# EAGLE design sqrwear2.0 (EAGLE 6.4)
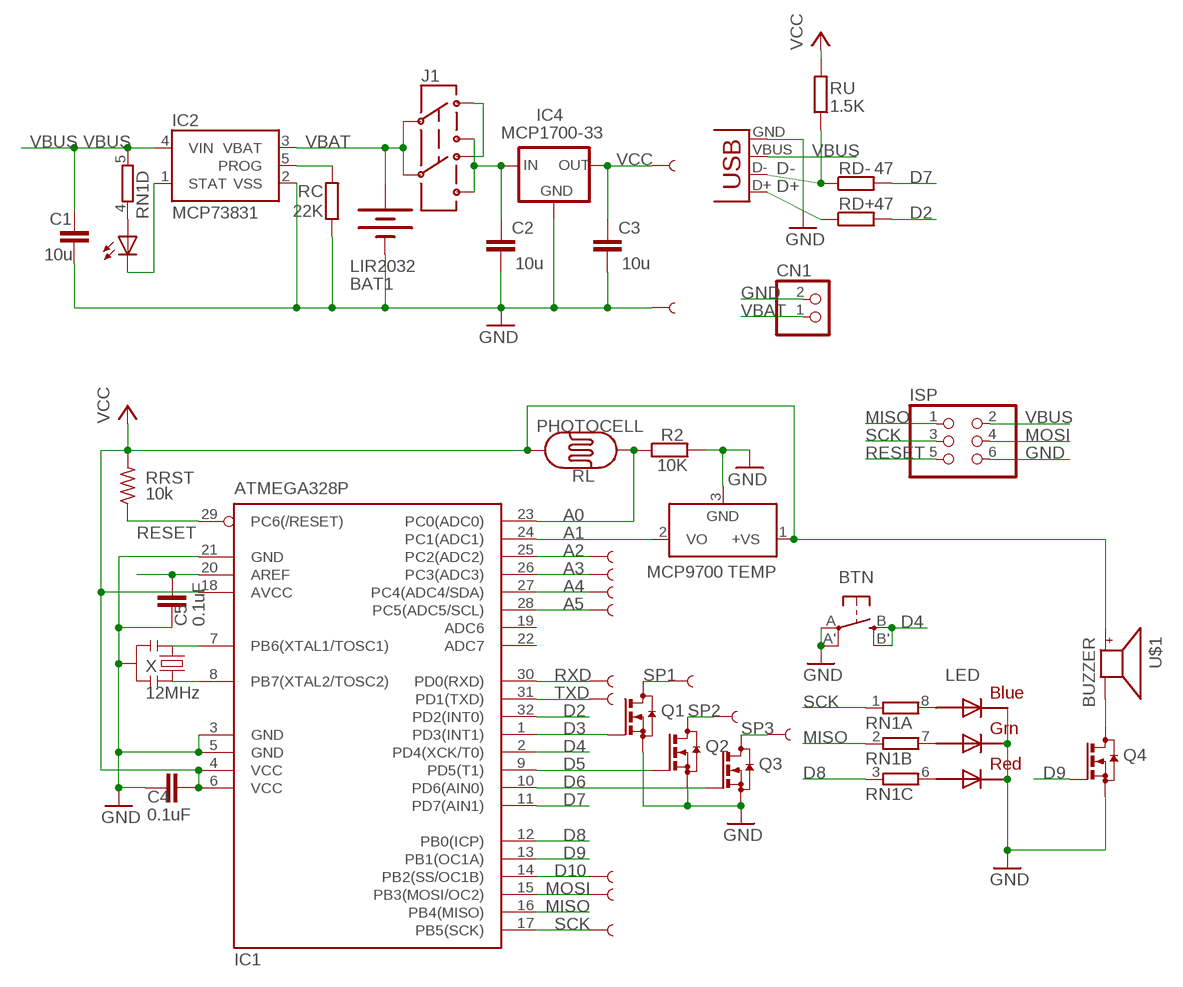
[diagram p0: schematic, sheet 1]

## Parts
BAT1  LIR2032  BATTERYBATTCOM_20MM_PTH_SMT  [BATTCOM_20MM_PTH_SMT]
BTN  EVQQ2  [EVQ-Q2]
C1  10u  C-EUC0805  [C0805]
C2  10u  C-EUC0805  [C0805]
C3  10u  C-EUC0805  [C0805]
C4  0.1uF  C-EUC0805  [C0805]
C5  0.1uF  C-EUC0805  [C0805]
CHG  0805  LEDCHIPLED_0805  [CHIPLED_0805]
CN1  JST_2PIN-SMT-RA  [JST-PH-2-SMT-RA]
IC1  ATMEGA328P  MEGA8-AI  [TQFP32-08]
IC2  MCP73831  [SOT23-5]
IC4  MCP1700-33  MCP1700SOT233  [SOT23]
ISP  PINHD-2X3  [2X03]
J1  AYZ0202  [AYZ0202]
LED  RGBLED5050  [RGBLED5050]
PAD_3  SEWTAP6  SEWTAP611  [PETAL-SMALL-2SIDE11]
PAD_5  SEWTAP6  SEWTAP61  [PETAL-SMALL-2SIDE1]
PAD_6  SEWTAP6  SEWTAP61  [PETAL-SMALL-2SIDE1]
PAD_10  SEWTAP6  SEWTAP611  [PETAL-SMALL-2SIDE11]
PAD_11  SEWTAP6  SEWTAP61  [PETAL-SMALL-2SIDE1]
PAD_13  SEWTAP6  SEWTAP61  [PETAL-SMALL-2SIDE1]
PAD_A2  SEWTAP6  SEWTAP61  [PETAL-SMALL-2SIDE1]
PAD_A3  SEWTAP6  SEWTAP61  [PETAL-SMALL-2SIDE1]
PAD_A4  SEWTAP6  SEWTAP611  [PETAL-SMALL-2SIDE11]
PAD_A5  SEWTAP6  SEWTAP611  [PETAL-SMALL-2SIDE11]
PAD_GND  SEWTAP6  SEWTAP611  [PETAL-SMALL-2SIDE11]
PAD_RXD  SEWTAP61  [PETAL-SMALL-2SIDE1]
PAD_TXD  SEWTAP6  SEWTAP61  [PETAL-SMALL-2SIDE1]
PAD_VCC  SEWTAP6  SEWTAP611  [PETAL-SMALL-2SIDE11]
Q1  BSS123  [SOT23]
Q2  BSS123  [SOT23]
Q3  BSS123  [SOT23]
Q4  BSS123  [SOT23]
R2  10K  R-EU_R0805  [R0805]
RC  22K  R-EU_R0805  [R0805]
RD+  47  R-EU_R0805  [R0805]
RD-  47  R-EU_R0805  [R0805]
RL  PHOTOCELL  PHOTOCELLPTH  [PHOTOCELL]
RN1  4R-NEXB38V  [EXB38V]
RRST  10k  R-US_R0805  [R0805@1]
RU  1.5K  R-EU_R0805  [R0805]
TEMP  MCP9700  LM50  [SOT23]
U$1  BUZZER  [SMT-8585-BUZZER]
X  12MHz  RESONATORSMD  [RESONATOR-SMD]
X1  USBSMD  [USB-MINIB]

## Nets
A0: IC1.23(PC0(ADC0)) R2.1 RL.1
A1: IC1.24(PC1(ADC1)) TEMP.2(VO)
A2: IC1.25(PC2(ADC2)) PAD_A2.1
A3: IC1.26(PC3(ADC3)) PAD_A3.1
A4: IC1.27(PC4(ADC4/SDA)) PAD_A4.1
A5: IC1.28(PC5(ADC5/SCL)) PAD_A5.1
AREF: C5.2 IC1.20(AREF)
D2: IC1.32(PD2(INT0)) RD+.2
D3: IC1.1(PD3(INT1)) Q1.1(G)
D4: BTN.B'(S1) BTN.B(S) IC1.2(PD4(XCK/T0))
D5: IC1.9(PD5(T1)) Q2.1(G)
D6: IC1.10(PD6(AIN0)) Q3.1(G)
D7: IC1.11(PD7(AIN1)) RD-.2
D8: IC1.12(PB0(ICP)) RN1.3
D9: IC1.13(PB1(OC1A)) Q4.1(G)
D10: IC1.14(PB2(SS/OC1B)) PAD_10.1
D+: RD+.1 X1.D+
D-: RD-.1 RU.1 X1.D-
GND: BAT1.P$1(-) BTN.A'(P1) BTN.A(P) C1.2 C2.2 C3.2 C4.1 C5.1 CN1.2 IC1.3(GND) IC1.5(GND) IC1.21(GND) IC2.2(VSS) IC4.1(GND) ISP.6 LED.4(BLUE_C) LED.5(RED_C) LED.6(GREEN_C) PAD_GND.1 Q1.2(S) Q2.2(S) Q3.2(S) Q4.2(S) R2.2 RC.1 TEMP.3(GND) X1.GND X.2
MISO: IC1.16(PB4(MISO)) ISP.1 RN1.2
MOSI: IC1.15(PB3(MOSI/OC2)) ISP.4 PAD_11.1
N$1: J1.3 J1.6
N$2: IC1.7(PB6(XTAL1/TOSC1)) X.1
N$3: IC1.8(PB7(XTAL2/TOSC2)) X.3
N$4: LED.3(BLUE_A) RN1.8
N$5: CHG.C IC2.1(STAT)
N$6: IC2.5(PROG) RC.2
N$7: Q4.3(D) U$1.-
N$8: LED.1(GREEN_A) RN1.7
N$9: LED.2(RED_A) RN1.6
N$10: CHG.A RN1.4
RESET: IC1.29(PC6(/RESET)) ISP.5 RRST.1
RXD: IC1.30(PD0(RXD)) PAD_RXD.1
SCK: IC1.17(PB5(SCK)) ISP.3 PAD_13.1 RN1.1
SP1: PAD_3.1 Q1.3(D)
SP2: PAD_5.1 Q2.3(D)
SP3: PAD_6.1 Q3.3(D)
TXD: IC1.31(PD1(TXD)) PAD_TXD.1
VBAT: BAT1.P$2(+) CN1.1 IC2.3(VBAT) J1.2 J1.5
VBUS: C1.1 IC2.4(VIN) ISP.2 RN1.5 X1.VBUS
VCC: C3.1 C4.2 IC1.4(VCC) IC1.6(VCC) IC1.18(AVCC) IC4.2(OUT) PAD_VCC.1 RL.2 RRST.2 RU.2 TEMP.1(+VS) U$1.+
VDD: C2.1 IC4.3(IN) J1.1 J1.4
Unconnected: IC1.19(ADC6) IC1.22(ADC7)

## Library data of the parts
BAT1 = SparkFunNew:BATTERY: Battery Holders Various common sizes : AA, AAA, 20mm coin cell and 12mm coin cell.
BTN = adafruit:EVQQ2: SMT 6mm switch, EVQQ2 series http://www.ladyada.net/library/eagle
C1-C3 = resistor:C-EU: CAPACITOR, European symbol
C4 C5 = rcl:C-EU: CAPACITOR, European symbol
CHG = led:LED: LED OSRAM: - CHIPLED LG R971, LG N971, LY N971, LG Q971, LY Q971, LO R971, LY R971 LH N974, LH R974 LS Q976, LO Q976, LY Q976 LO Q996 - Hyper CHIPLED LW Q18S LB Q993, LB Q99A, LB R99A - SideLED LS A670, LO A670, LY A670, LG A670, LP A670 LB A673, LV A673, LT A673, LW A673 LH A674 LY A675 LS A676, LA A676, LO A676, LY A676, LW A676 LS A679, LY A679, LG A679 - Hyper Micro SIDELED® LS Y876, LA Y876, LO Y876, LY Y876 LT Y87S - SmartLED LW L88C, LW L88S LB L89C, LB L89S, LG L890 LS L89K, LO L89K, LY L89K LS L896, LA L896, LO L896, LY L896 - TOPLED LS T670, LO T670, LY T670, LG T670, LP T670 LSG T670, LSP T670, LSY T670, LOP T670, LYG T670 LG T671, LOG T671, LSG T671 LB T673, LV T673, LT T673, LW T673 LH T674 LS T676, LA T676, LO T676, LY T676, LB T676, LH T676, LSB T676, LW T676 LB T67C, LV T67C, LT T67C, LS T67K, LO T67K, LY T67K, LW E67C LS E67B, LA E67B, LO E67B, LY E67B, LB E67C, LV E67C, LT E67C LW T67C LS T679, LY T679, LG T679 LS T770, LO T770, LY T770, LG T770, LP T770 LB T773, LV T773, LT T773, LW T773 LH T774 LS E675, LA E675, LY E675, LS T675 LS T776, LA T776, LO T776, LY T776, LB T776 LHGB T686 LT T68C, LB T68C - Hyper Mini TOPLED® LB M676 - Mini TOPLED Santana® LG M470 LS M47K, LO M47K, LY M47K Source: http://www.osram.convergy.de LUXEON: - LUMILED® LXK2-PW12-R00, LXK2-PW12-S00, LXK2-PW14-U00, LXK2-PW14-V00 LXK2-PM12-R00, LXK2-PM12-S00, LXK2-PM14-U00 LXK2-PE12-Q00, LXK2-PE12-R00, LXK2-PE12-S00, LXK2-PE14-T00, LXK2-PE14-U00 LXK2-PB12-K00, LXK2-PB12-L00, LXK2-PB12-M00, LXK2-PB14-N00, LXK2-PB14-P00, LXK2-PB14-Q00 LXK2-PR12-L00, LXK2-PR12-M00, LXK2-PR14-Q00, LXK2-PR14-R00 LXK2-PD12-Q00, LXK2-PD12-R00, LXK2-PD12-S00 LXK2-PH12-R00, LXK2-PH12-S00 LXK2-PL12-P00, LXK2-PL12-Q00, LXK2-PL12-R00 Source: www.luxeon.com KINGBRIGHT: KA-3528ASYC Source: www.kingbright.com
CN1 = adafruit:JST_2PIN: JST 2-Pin Connectors of various flavors SMT-RA (S2B-PH-SM4) 4UConnector #17311 SMT (B2B-PH-SM4) THM-RA (S2B-PH) THM (B2B-PH)
IC1 = atmel:MEGA8: MICROCONTROLLER 8 Kbytes FLASH, 1 kbytes SRAM, 512 bytes EEPROM, USART, 6-channel 10 bit ADC, 2-channel 8 bit ADC Pin compatible with Atmega48, ATMega88, ATMega168 Source: avr.lbr; MPN: ATMEGA8-16AU; OC_FARNELL: 9171371; OC_NEWARK: 73M8863
IC2 = SparkFunNew:MCP73831: Microchip's MCP73831 Miniature single cell, fully integrated Li-Ion, Li-polymer charge management controller http://ww1.microchip.com/downloads/en/DeviceDoc/21984a.pdf
IC4 = adafruit:MCP1700: VOLTAGE REGULATOR
ISP = pinhead:PINHD-2X3: PIN HEADER
J1 = SparkFunNew:AYZ0202: SPDT Slide Switch Simple SMD single-pull double-throw slide switch. Good for less than 350mA power switch, switching UARTs between devices, etc. Spark Fun Electronics SKU : COM-00597
LED = adafruit:RGBLED: For 5050 RGB LEDs, the order of the LEDs may vary from one manufacturer to another!
PAD_3 PAD_5 PAD_6 PAD_10 PAD_11 PAD_13 PAD_A2-PAD_A5 PAD_GND PAD_RXD PAD_TXD PAD_VCC = LilyPad-Wearables:SEWTAP
Q1-Q4 = transistor-small-signal:BSS123: N-CHANNEL MOS FET
R2 RC RD+ RD- RU = rcl:R-EU_: RESISTOR, European symbol
RL = SparkFunNew:PHOTOCELL: Photocell Also known as a CdS photoresistor. This is a low cost way to detect light levels. Resistance decreases with more incoming light. SparkFun SKU: SEN-09088
RN1 = resistor-dil:4R-N: Array Chip Resistor Source: RS Component / Phycomp; OC_FARNELL: unknown; OC_NEWARK: unknown
RRST = rcl:R-US_: RESISTOR, American symbol
TEMP = linear:LM50: SOT-23 Single-Supply Centigrade Temperature Sensor Vout = (10mV/°C x Temp °C) +5mmmV Source: http://cache.national.com/ds/LM/LM50.pdf
U$1 = adafruit:BUZZER
X = SparkFunNew:RESONATOR: Resonator Small SMD resonator. This is the itty bitty 10/20MHz resonators with built in caps. CSTCE10M0G55 and CSTCE20M0V53. Footprint has been reviewed closely but hasn't been tested yet.
X1 = SparkFun:USB: USB Connectors USB-B-PTH is fully proven SKU : PRT-00139 USB-miniB is fully proven SKU : PRT-00587 USB-A-PCB is untested. USB-A-H is throughly reviewed, but untested. Spark Fun Electronics SKU : PRT-00437 USB-B-SMT is throughly reviewed, but untested. Needs silkscreen touching up. USB-A-S has not been used/tested USB-MB-H has not been used/tested

## Net classes
0 default: width 0.254 mm, clearance 0.203 mm
1 power: width 0.254 mm, clearance 0.203 mm

## Board
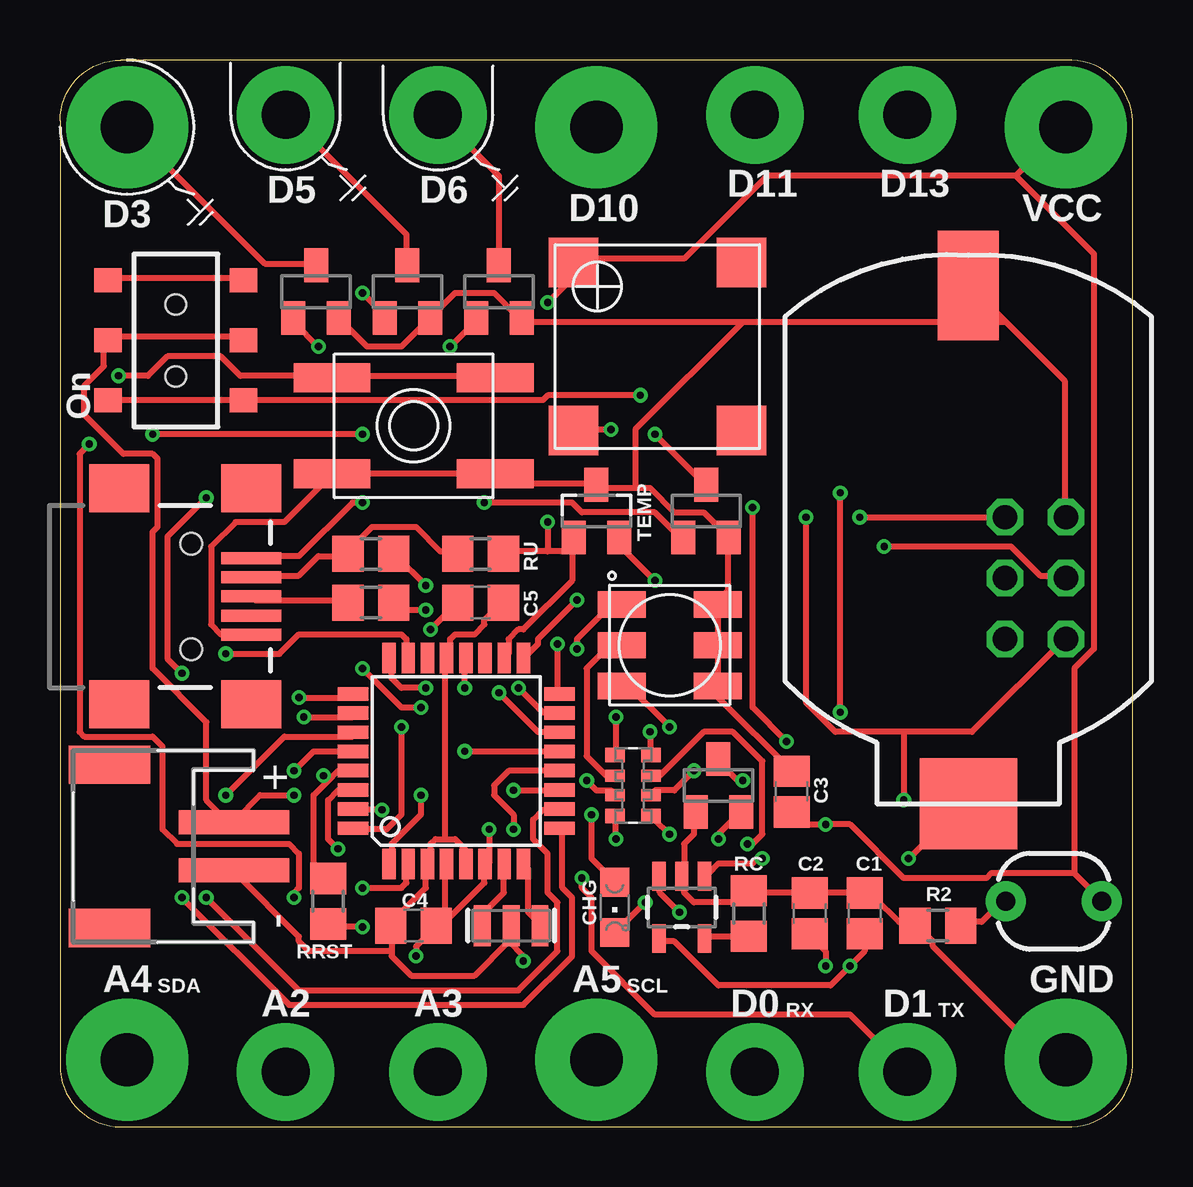
[diagram p1: board, top side]
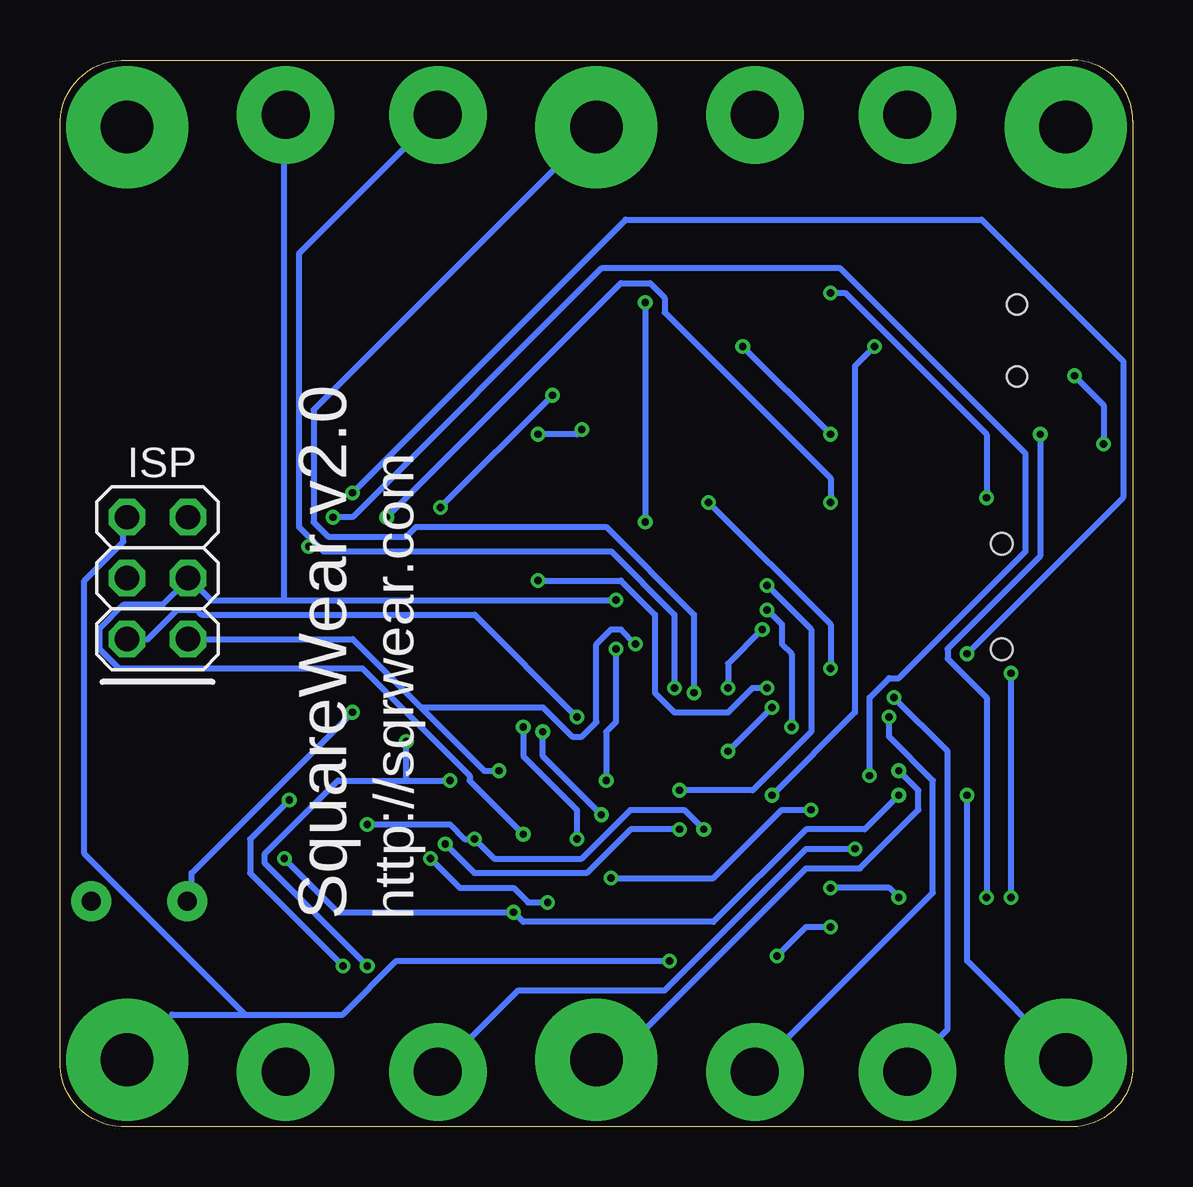
[diagram p2: board, bottom side, seen from below]

Size 44.7 x 44.45 mm. Coordinates in mm from the lower left corner, seen from the top.
Outline: 2.54,0 41.91,0 arc90 44.7,2.54 44.7,41.91 arc90 41.91,44.45 2.54,44.45 arc90 0,41.91 0,2.54 arc90 2.54,0
Copper layers (1*16): Top 0.035mm / dielectric 1.5mm / Bottom 0.035mm
Design rules "Fusion_eagle_rule_v1.1 *": minimum track width 6mil, minimum drill 12mil, track to track 6mil, track to pad 6mil, pad to pad 6mil, via to via 6mil, smd to smd 0mil, copper to edge 10mil, drill to drill 10mil, minimum pad ring 10mil, minimum via ring 6mil, stop-mask expansion 2mil, vias tented up to drill 100mil, thermal gap 25mil
vRestrict: area 21.6,8.4 to 22.4,9.9; area 1.5,37.6 to 6.6,38.6; area 8.1,38.4 to 12.7,39.6; area 14.2,38.4 to 18.8,39.6; area 27.7,38.9 to 30.5,39.9; area 40.4,37.8 to 43.2,38.9; area 40.4,5.6 to 43.2,6.6; area 8.4,14 to 9.4,15; area 20.8,37.6 to 24.1,38.9; area 21.3,5.6 to 24.9,6.9

### Footprints (pad centres in the part's own frame; a part is rotated, then mirrored left to right if it is on the bottom)
BATTCOM_20MM_PTH_SMT = smd 4.572 x 2.54: P$1 0,0 | smd 3.81 x 4.064: P$2 21.59,0
EVQ-Q2 = smd 3.2 x 1.2: A -3.4,-2; A' 3.4,-2; B -3.4,2; B' 3.4,2
C0805 = smd 1.3 x 1.5: 1 -0.85,0; 2 0.85,0
C0805' = smd 1.3 x 1.5: 1 -0.95,0; 2 0.95,0
CHIPLED_0805 = smd 1.2 x 1.2: A 0,-1.05; C 0,1.05
JST-PH-2-SMT-RA = smd 1 x 4.6: 1 1,-3.7; 2 -1,-3.7 | smd 1.6 x 3.4: NC1 -3.4,1.5; NC2 3.4,1.5
TQFP32-08 = smd 1.27 x 0.559: 1 -4.293,2.8; 2 -4.293,2; 3 -4.293,1.2; 4 -4.293,0.4; 5 -4.293,-0.4; 6 -4.293,-1.2; 7 -4.293,-2; 8 -4.293,-2.8; 17 4.293,-2.8; 18 4.293,-2; 19 4.293,-1.2; 20 4.293,-0.4; 21 4.293,0.4; 22 4.293,1.2; 23 4.293,2; 24 4.293,2.8 | smd 0.559 x 1.27: 9 -2.8,-4.293; 10 -2,-4.293; 11 -1.2,-4.293; 12 -0.4,-4.293; 13 0.4,-4.293; 14 1.2,-4.293; 15 2,-4.293; 16 2.8,-4.293; 25 2.8,4.293; 26 2,4.293; 27 1.2,4.293; 28 0.4,4.293; 29 -0.4,4.293; 30 -1.2,4.293; 31 -2,4.293; 32 -2.8,4.293
SOT23-5 = smd 0.55 x 1.2: 1 -0.95,-1.3; 2 0,-1.3; 3 0.95,-1.3; 4 0.95,1.3; 5 -0.95,1.3
SOT23 = smd 1 x 1.4: 1 -0.95,-1.1; 2 0.95,-1.1; 3 0,1.1
2X03 = drill 1.016 octagon: 1 -2.54,-1.27; 2 -2.54,1.27; 3 0,-1.27; 4 0,1.27; 5 2.54,-1.27; 6 2.54,1.27
AYZ0202 = smd 1 x 1.15: 1 -2.5,2.825; 2 0,2.825; 3 2.5,2.825; 4 -2.5,-2.825; 5 0,-2.825; 6 2.5,-2.825 | hole 0.85: 1.5,0; -1.5,0
RGBLED5050 = smd 2 x 1.1: 1 -2,1.7; 2 -2,0; 3 -2,-1.7; 4 2,-1.7; 5 2,0; 6 2,1.7
PETAL-SMALL-2SIDE11 = drill 2.2 pad 5.08: 1 0,0
PETAL-SMALL-2SIDE1 = drill 2 pad 4.064: 1 0,0
R0805 = smd 1.3 x 1.5: 1 -0.95,0; 2 0.95,0
PHOTOCELL = drill 0.8 pad 1.676: 1 -2,0; 2 2,0
EXB38V = smd 0.6 x 0.8: 1 -1.275,-0.75; 4 1.275,-0.75; 5 1.275,0.75; 8 -1.275,0.75 | smd 0.5 x 0.8: 2 -0.4,-0.75; 3 0.4,-0.75; 6 0.4,0.75; 7 -0.4,0.75
R0805@1 = smd 1.3 x 1.5: 1 -0.95,0; 2 0.95,0
SMT-8585-BUZZER = smd 2.05 x 2.05: + -3.5,-3.5; - 3.5,-3.5; NC1 -3.5,3.5; NC2 3.5,3.5
RESONATOR-SMD = smd 0.7 x 1.7: 1 -1.2,0; 2 0,0; 3 1.2,0
USB-MINIB = smd 2.5 x 0.5: D+ 2.5,0; D- 2.5,0.8; GND 2.5,-1.6; ID 2.5,-0.8; VBUS 2.5,1.6 | smd 2.5 x 2: GND@1 -3,-4.5; GND@2 -3,4.5; GND@3 2.5,4.5; GND@4 2.5,-4.5 | hole 0.9: 0,2.2; 0,-2.2

### Placement (x,y rotation side)
BAT1  37.85,35.05 270 top
BTN  14.73,29.21 0 top
C1  33.53,8.89 90 top
C2  31.24,8.89 90 top
C3  30.48,13.97 90 top
C4  0.1uF  [C0805']  14.73,8.38 0 top
C5  0.1uF  [C0805']  17.53,21.84 180 top
CHG  23.11,9.14 180 top
CN1  3.56,11.68 90 top
IC1  16.51,15.24 90 top
IC2  25.91,9.14 180 top
IC4  27.43,14.22 0 top
ISP  40.64,22.86 90 bottom
J1  4.83,32.77 90 top
LED  25.4,20.07 0 top
PAD_3  2.79,41.66 180 top
PAD_5  9.4,42.16 180 top
PAD_6  15.75,42.16 0 top
PAD_10  22.35,41.66 180 top
PAD_11  28.96,42.16 180 top
PAD_13  35.31,42.16 180 top
PAD_A2  9.4,2.29 0 top
PAD_A3  15.75,2.29 0 top
PAD_A4  2.79,2.79 90 top
PAD_A5  22.35,2.79 0 top
PAD_GND  41.91,2.79 270 top
PAD_RXD  28.96,2.29 180 top
PAD_TXD  35.31,2.29 0 top
PAD_VCC  41.91,41.66 180 top
Q1  10.67,34.8 0 top
Q2  14.48,34.8 0 top
Q3  18.29,34.8 0 top
Q4  26.92,25.65 0 top
R2  36.58,8.38 180 top
RC  28.7,8.89 270 top
RD+  12.95,21.84 0 top
RD-  12.95,23.88 0 top
RL  41.4,9.4 0 top
RN1  23.88,14.22 90 top
RRST  11.18,9.4 270 top
RU  17.53,23.88 0 top
TEMP  22.35,25.65 0 top
U$1  24.89,32.51 270 top
X  18.8,8.38 0 top
X1  5.46,22.1 0 top

### Tracks (layer width: path | path; a pad name or v marks a point on that pad's centre or on a via)
A0  (via drill 0.3)
  Top 0.254: v6.91,19.71 9.14,19.71 9.96,20.52 14.22,20.52 14.43,20.32 14.43,19.71 IC1.23 | v32.51,17.27 v32.51,26.42 | R2.1 37.59,8.53 38.41,8.53 39.22,9.35 RL.1
  Bottom 0.254: v6.91,19.71 0.41,26.21 0.41,31.9 6.3,37.8 21.13,37.8 v32.51,26.42 | v32.51,17.27 39.22,10.57 39.22,9.55 RL.1
A1  (via drill 0.3)
  Top 0.254: v15.24,18.29 14.22,18.29 13.82,18.69 13.82,19.51 IC1.24 | v24.79,22.76 23.16,24.38 TEMP.2
  Bottom 0.254: v15.24,18.29 15.85,18.29 16.87,17.27 19.1,17.27 19.91,18.09 19.91,21.34 21.34,22.76 v24.79,22.76
A2  (via drill 0.3)
  Top 0.254: v9.96,17.88 12.19,17.88 IC1.25
  Bottom 0.254: v9.96,17.88 7.72,15.65 7.72,4.06 9.35,2.44 PAD_A2.1
A3  (via drill 0.3)
  Top 0.254: v10.16,17.07 12.19,17.07 IC1.26
  Bottom 0.254: v10.16,17.07 10.16,16.26 8.33,14.43 8.33,9.75 15.65,2.44 PAD_A3.1
A4  (via drill 0.3)
  Top 0.254: v6.91,13.82 9.35,16.26 12.19,16.26 IC1.27
  Bottom 0.254: v6.91,13.82 6.91,6.91 PAD_A4.1
A5  (via drill 0.3)
  Top 0.254: v9.75,14.83 10.57,15.65 12.19,15.65 IC1.28
  Bottom 0.254: v9.75,14.83 8.94,14.02 8.94,13.21 11.38,10.77 13.61,10.77 21.54,2.85 22.35,2.85 PAD_A5.1
AREF  (via drill 0.3)
  Top 0.254: v16.87,18.29 16.87,19.51 IC1.20 | v15.44,20.73 16.46,21.74 C5.2
  Bottom 0.254: v16.87,18.29 16.87,19.3 v15.44,20.73
D2  (via drill 0.3)
  Top 0.254: v14.22,16.66 14.22,13.01 13.61,12.4 12.39,12.4 IC1.32 | v15.24,21.54 14.22,21.54 14.02,21.74 RD+.2
  Bottom 0.254: v14.22,16.66 14.22,19.71 14.63,20.12 14.63,20.93 v15.24,21.54
D3  (via drill 0.3)
  Top 0.254: v15.04,13.82 15.04,13.01 13.82,11.79 13.82,10.97 IC1.1 | v10.77,32.51 9.75,33.53 Q1.1
  Bottom 0.254: v15.04,13.82 11.58,17.27 11.58,31.7 v10.77,32.51
D4  (via drill 0.3)
  Top 0.254: v12.6,9.96 14.22,9.96 14.43,10.16 14.43,10.77 IC1.2 | v9.75,9.55 9.75,9.75 9.96,9.96 9.96,11.38 9.55,11.79 4.88,11.79 4.27,12.4 4.27,15.85 3.86,16.26 1.02,16.26 0.81,16.46 0.81,28.04 v1.22,28.45 | v2.44,31.29 3.66,31.29 4.47,32.11 6.71,32.11 7.52,31.29 11.18,31.29 BTN.B 11.38,31.29 18.09,31.29 BTN.B'
  Bottom 0.254: v12.6,9.96 10.16,9.96 v9.75,9.55 | v1.22,28.45 1.22,30.07 v2.44,31.29
D5  (via drill 0.3)
  Top 0.254: v5.08,9.55 9.55,5.08 19.3,5.08 21.34,7.11 21.34,9.55 20.93,9.96 20.93,12.4 IC1.9 | v5.08,18.9 4.47,19.51 4.47,24.59 v6.1,26.21 | v12.6,34.75 13.61,33.73 Q2.1
  Bottom 0.254: v5.08,18.9 v5.08,9.55 | v6.1,26.21 6.1,28.85 11.99,34.75 v12.6,34.75
D6  (via drill 0.3)
  Top 0.254: v6.1,9.55 9.96,5.69 19.1,5.69 20.73,7.32 20.73,9.35 20.32,9.75 20.32,11.38 19.71,11.99 19.71,12.8 20.12,13.21 20.73,13.21 IC1.10 | v12.6,28.85 v3.86,28.85 | v16.26,32.51 17.27,33.53 Q3.1
  Bottom 0.254: v6.1,9.55 6.1,17.88 7.72,19.51 7.72,19.91 3.86,23.77 v3.86,28.85 | v16.26,32.51 v12.6,28.85
D7  (via drill 0.3)
  Top 0.254: v18.9,14.02 20.73,14.02 IC1.11 | v15.24,22.56 14.02,23.77 RD-.2
  Bottom 0.254: v18.9,14.02 15.85,14.02 13.41,16.46 13.41,20.73 v15.24,22.56
D8  (via drill 0.3)
  Top 0.254: v28.65,11.79 28.85,11.79 29.26,12.19 29.26,15.24 28.04,16.46 26.82,16.46 24.99,14.63 24.79,14.63 RN1.3 | v18.9,12.4 18.9,13.01 18.09,13.82 18.09,14.22 18.69,14.83 20.73,14.83 IC1.12
  Bottom 0.254: v28.65,11.79 27.43,10.57 22.76,10.57 20.93,12.4 v18.9,12.4
D9  (via drill 0.3)
  Top 0.254: v16.87,15.65 20.73,15.65 IC1.13 | v15.04,17.48 14.22,17.48 v12.6,19.1 | v17.68,26.01 21.34,26.01 21.74,25.6 24.79,25.6 25.81,24.59 Q4.1
  Bottom 0.254: v15.04,17.48 v16.87,15.65 | v12.6,19.1 12.6,20.93 v17.68,26.01
D10  (via drill 0.3)
  Top 0.254: v18.29,18.09 19.91,16.46 20.73,16.46 IC1.14
  Bottom 0.254: v18.29,18.09 18.29,21.34 21.95,24.99 29.87,24.99 30.28,24.59 33.53,24.59 34.14,25.2 34.14,29.87 PAD_10.1
D+
  Top 0.254: RD+.1 11.99,21.95 8.13,21.95 X1.D+
D-
  Top 0.254: X1.D- 8.13,22.96 9.96,22.96 10.77,23.77 11.99,23.77 RD-.1 11.99,23.98 13.01,24.99 14.83,24.99 15.85,23.98 16.46,23.98 RU.1
GND  (via drill 0.3)
  Top 0.254: C3.2 30.48,14.83 27.43,17.88 27.43,18.29 LED.4 27.43,18.49 27.43,19.91 LED.5 27.43,20.12 27.43,21.74 LED.6 27.43,21.95 27.84,22.35 27.84,24.38 Q4.2 27.84,24.59 26.82,25.6 25.6,25.6 24.59,26.62 23.98,26.62 | X1.GND 7.92,20.52 6.71,20.52 6.3,20.93 6.3,24.18 7.32,25.2 9.35,25.2 11.18,27.03 BTN.A 11.38,27.23 18.09,27.23 BTN.A' 18.29,27.03 18.49,26.82 22.35,26.82 TEMP.3 22.35,26.62 23.98,26.62 | Q1.2 11.79,33.53 12.8,32.51 14.22,32.51 15.24,33.53 Q2.2 15.44,33.73 16.46,34.75 18.09,34.75 19.1,33.73 Q3.2 19.3,33.53 28.45,33.53 | 39.42,33.53 38,34.95 BAT1.P$1 | 39.42,33.53 41.86,31.09 41.86,25.4 ISP.6 | 39.42,33.53 28.45,33.53 | 23.98,26.62 23.98,29.06 28.45,33.53 | 16.05,11.99 15.65,11.99 15.44,11.79 15.44,10.97 IC1.3 15.24,10.77 15.24,9.96 13.82,8.53 C4.1 13.82,8.33 13.82,7.32 | 16.05,11.99 16.46,11.99 16.87,11.58 16.87,10.97 IC1.5 | 16.05,11.99 16.05,19.51 IC1.21 16.26,19.71 16.26,20.32 16.46,20.52 17.27,20.52 17.68,20.93 17.68,21.13 18.29,21.74 C5.1 | 18.69,7.72 18.69,8.33 X.2 18.69,7.72 | 18.69,7.72 17.27,6.3 14.63,6.3 13.82,7.11 13.82,7.32 | 13.82,7.32 10.36,7.32 9.96,7.72 9.96,7.93 7.32,10.57 CN1.2 | IC4.1 26.42,13.01 26.42,12.19 26.01,11.79 26.01,10.57 IC2.2 26.01,10.36 26.01,9.75 26.42,9.35 28.25,9.35 28.65,9.75 RC.1 28.85,9.75 31.09,9.75 C2.2 31.29,9.75 33.53,9.75 C1.2 33.53,9.55 33.93,9.55 34.95,8.53 35.56,8.53 R2.2 35.76,8.33 36.37,7.72 36.37,7.52 41.05,2.85 41.86,2.85 PAD_GND.1 | 18.69,7.72 19.3,7.11 v19.3,6.91
  Bottom 0.254: v19.3,6.91 30.68,6.91 32.92,4.67 36.98,4.67 | 36.98,4.67 40.03,4.67 PAD_GND.1 | 36.98,4.67 43.69,11.38 43.69,22.76 42.06,24.38 42.06,25.4 ISP.6
MISO  (via drill 0.3)
  Top 0.254: v26.42,14.83 25.6,14.02 24.79,14.02 RN1.2 | v20.73,20.12 20.73,18.09 IC1.16
  Bottom 0.254: v26.42,14.83 27.03,14.83 29.67,17.48 | 29.67,17.48 32.51,20.32 ISP.1 | v20.73,20.12 21.34,20.73 21.74,20.73 22.35,20.12 22.35,16.87 22.96,16.26 23.37,16.26 24.59,17.48 29.67,17.48
MOSI  (via drill 0.3)
  Top 0.254: v19.1,18.29 20.12,17.27 20.73,17.27 IC1.15 | v34.34,24.18 39.62,24.18 40.84,22.96 41.86,22.96 ISP.4
  Bottom 0.254: v19.1,18.29 19.1,21.34 21.74,23.98 33.73,23.98 34.14,24.38 | 34.14,24.38 34.75,24.99 34.75,36.37 PAD_11.1 | 34.14,24.38 v34.34,24.18
N$1
  Top 0.254: J1.3 2.03,35.36 7.52,35.36 J1.6
N$2
  Top 0.254: IC1.7 18.49,10.77 18.49,9.75 17.68,8.94 17.68,8.53 X.1
N$3
  Top 0.254: IC1.8 19.51,10.77 19.51,8.94 19.91,8.53 X.3
N$4  (via drill 0.3)
  Top 0.254: v23.16,11.99 23.16,12.8 RN1.8 | v25.4,16.66 23.57,18.49 LED.3
  Bottom 0.254: v23.16,11.99 23.16,13.21 25.4,15.44 v25.4,16.66
N$5  (via drill 0.3)
  Top 0.254: v24.38,9.35 23.16,8.13 CHG.C | v29.26,11.18 29.06,11.18 28.85,10.97 27.43,10.97 27.03,10.57 IC2.1
  Bottom 0.254: v24.38,9.35 25.2,9.35 25.81,9.96 28.04,9.96 v29.26,11.18
N$6
  Top 0.254: IC2.5 27.03,7.93 28.65,7.93 RC.2
N$7  (via drill 0.3)
  Top 0.254: v24.79,28.85 26.82,26.82 Q4.3 | v22.96,29.06 21.54,29.06 U$1.-
  Bottom 0.254: v24.79,28.85 23.16,28.85 v22.96,29.06
N$8  (via drill 0.3)
  Top 0.254: v21.95,14.43 22.35,14.02 22.96,14.02 RN1.7 | v21.54,19.91 21.54,20.32 22.96,21.74 23.37,21.74 LED.1
  Bottom 0.254: v21.95,14.43 21.95,16.46 21.54,16.87 v21.54,19.91
N$9
  Top 0.254: RN1.6 22.96,14.63 22.76,14.63 21.95,15.44 21.95,19.1 22.76,19.91 23.37,19.91 LED.2
N$10  (via drill 0.3)
  Top 0.254: v24.59,16.46 24.59,15.65 RN1.4 | v22.15,13.01 22.15,11.18 22.96,10.36 CHG.A
  Bottom 0.254: v24.59,16.46 24.59,15.44 v22.15,13.01
RESET  (via drill 0.3)
  Top 0.254: 11.18,14.43 10.57,13.82 10.57,10.97 11.18,10.36 RRST.1 | 11.18,14.43 11.58,14.83 12.19,14.83 IC1.29 | v33.33,25.4 ISP.5 | 11.18,14.43 v10.97,14.63
  Bottom 0.254: v33.33,25.4 32.51,25.4 22.15,35.76 12.19,35.76 4.47,28.04 4.47,23.98 9.75,18.69 10.16,18.69 10.97,17.88 v10.97,14.63
RXD  (via drill 0.3)
  Top 0.254: v11.58,11.58 11.18,11.99 11.18,13.61 11.58,14.02 12.19,14.02 IC1.30
  Bottom 0.254: v11.58,11.58 13.61,11.58 19.51,5.69 25.6,5.69 28.85,2.44 PAD_RXD.1
SCK  (via drill 0.3)
  Top 0.254: v25.4,12.19 24.79,12.8 RN1.1 | v21.54,21.95 19.91,20.32 19.91,20.12 19.51,19.71 IC1.17
  Bottom 0.254: v25.4,12.19 27.64,14.43 27.64,14.63 32.11,19.1 42.27,19.1 43.08,19.91 43.08,20.73 42.06,21.74 40.44,21.74 39.42,22.76 ISP.3 39.22,22.76 38.41,21.95 35.36,21.95 | 35.36,21.95 v21.54,21.95 | 35.36,21.95 35.36,42.06 PAD_13.1
SP1
  Top 0.254: Q1.3 10.57,35.97 8.53,35.97 2.85,41.66 PAD_3.1
SP2
  Top 0.254: Q2.3 14.43,35.97 14.43,37.19 9.55,42.06 PAD_5.1
SP3
  Top 0.254: Q3.3 18.29,39.62 PAD_6.1
TXD  (via drill 0.3)
  Top 0.254: v13.41,13.21 12.39,13.21 IC1.31 | v21.74,10.36 21.74,9.96 22.15,9.55 22.15,7.32 24.79,4.67 32.92,4.67 PAD_TXD.1
  Bottom 0.254: v13.41,13.21 14.63,13.21 17.48,10.36 v21.74,10.36
VBAT  (via drill 0.3)
  Top 0.254: J1.5 7.52,32.92 2.03,32.92 J1.2 1.83,32.72 1.83,31.7 1.02,30.89 1.02,29.67 2.64,28.04 3.86,28.04 4.06,27.84 4.06,24.99 3.86,24.79 3.86,19.1 6.1,16.87 6.1,13.61 7.11,12.6 CN1.1 7.32,12.8 8.33,13.82 v9.75,13.82 | v25.81,8.94 24.99,9.75 24.99,10.36 IC2.3 | v35.36,11.18 37.8,13.61 BAT1.P$2
  Bottom 0.254: v35.36,11.18 33.12,8.94 v25.81,8.94 25.4,8.53 17.48,8.53 13.61,12.4 11.18,12.4 v9.75,13.82
VBUS  (via drill 0.3)
  Top 0.254: C1.1 33.53,7.32 v32.92,6.71 32.11,5.89 27.43,5.89 25.6,7.72 24.99,7.72 IC2.4 | v23.16,17.07 23.16,15.65 RN1.5 | v12.6,26.01 12.19,26.01 9.96,23.77 8.13,23.77 X1.VBUS | v31.09,25.4 31.09,17.68 32.31,16.46 35.15,16.46 | 35.15,16.46 38,16.46 41.86,20.32 ISP.2 | 35.15,16.46 v35.15,13.61
  Bottom 0.254: v23.16,17.07 27.43,21.34 38.81,21.34 39.01,21.54 39.83,21.54 41.05,20.32 ISP.2 | v12.6,26.01 12.6,27.03 19.51,33.93 19.51,34.54 20.12,35.15 21.34,35.15 v31.09,25.4 | v32.92,6.71 36.78,10.57 36.78,11.99 v35.15,13.61
VCC  (via drill 0.3)
  Top 0.254: IC1.4 16.05,10.77 16.05,8.74 15.85,8.53 C4.2 | C4.2 15.85,8.33 17.68,10.16 17.68,10.77 IC1.6 17.88,10.97 v17.88,12.4 | v12.6,8.33 11.18,8.33 RRST.2 | v14.83,7.11 14.83,7.52 15.65,8.33 C4.2 | v27.43,11.99 27.43,12.19 28.25,13.01 IC4.2 | C3.1 30.48,13.01 30.89,12.6 v31.9,12.6 32.92,12.6 35.15,10.36 38.61,10.36 38.81,10.57 42.27,10.57 | 42.27,10.57 43.28,9.55 RL.2 | 21.34,23.98 21.34,24.38 TEMP.1 21.34,23.98 | 21.34,23.98 21.34,22.76 19.3,20.73 19.1,20.73 18.69,20.32 18.69,19.71 IC1.18 | 21.34,23.98 20.32,23.98 | 20.32,23.98 18.49,23.98 RU.2 | 22.15,36.17 26.01,36.17 29.46,39.62 39.83,39.62 | 22.15,36.17 21.54,36.17 U$1.+ 22.15,36.17 | 39.83,39.62 41.86,41.66 PAD_VCC.1 | v20.32,25.2 20.32,23.98 | 22.15,36.17 v20.32,34.34 | 42.27,10.57 42.27,19.1 43.08,19.91 43.08,36.37 39.83,39.62
  Bottom 0.254: v12.6,8.33 13.61,8.33 v14.83,7.11 | v31.9,12.6 28.45,12.6 27.84,11.99 v27.43,11.99 26.62,11.18 22.96,11.18 20.93,13.21 18.69,13.21 v17.88,12.4 | v20.32,34.34 v20.32,25.2
VDD  (via drill 0.3)
  Top 0.254: J1.1 2.03,30.28 7.52,30.28 J1.4 7.72,30.28 20.12,30.28 20.32,30.48 v24.18,30.48 | v28.45,14.43 28.25,14.43 27.43,15.24 IC4.3 | v31.9,6.71 31.9,7.32 31.29,7.93 C2.1 | v28.85,25.81 28.85,17.48 v30.28,16.05
  Bottom 0.254: 30.28,14.43 33.12,14.43 36.17,11.38 36.17,10.97 v31.9,6.71 | 30.28,14.43 v28.45,14.43 | v28.85,25.81 v24.18,30.48 | 30.28,14.43 v30.28,16.05

### Text on the board
tNames: D5 | D6 | D11 | D13 | D3 | D10 | VCC | On | A4 | SDA | A5 | SCL | GND | A2 | A3 | D0 | RX | D1 | TX
bNames: http://sqrwear.com | SquareWear v2.0